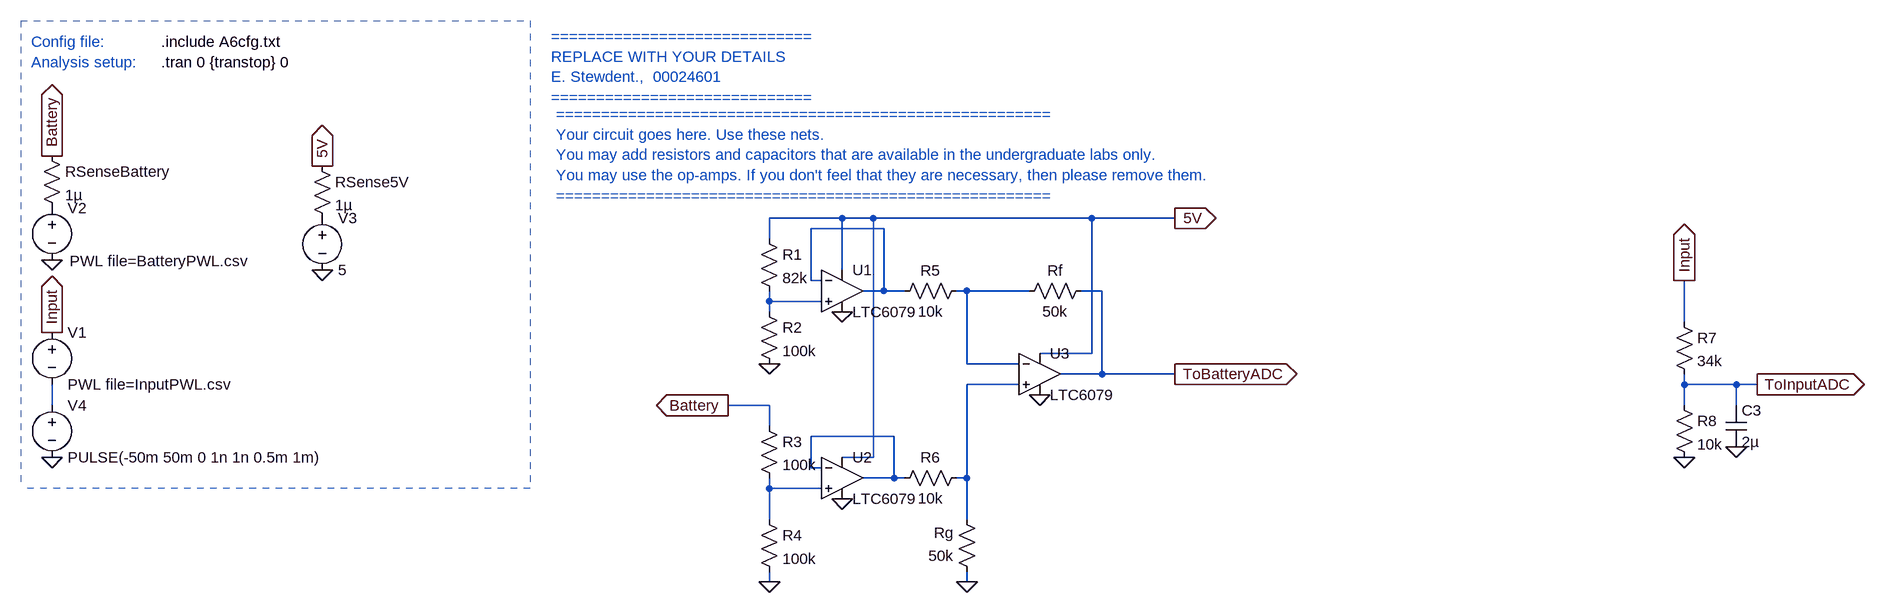
[diagram p0: schematic E344_22546448_A6.asc]
E344_22546448_A6.asc, the LTspice schematic file:
Version 4
SHEET 1 1824 680
WIRE -1104 -1120 -1216 -1120
WIRE -1056 -1120 -1104 -1120
WIRE -720 -1120 -1056 -1120
WIRE -592 -1120 -720 -1120
WIRE -1040 -1104 -1152 -1104
WIRE -1216 -1088 -1216 -1120
WIRE -1104 -1040 -1104 -1120
WIRE -1152 -1024 -1152 -1104
WIRE -1136 -1024 -1152 -1024
WIRE -1040 -1008 -1040 -1104
WIRE -1040 -1008 -1072 -1008
WIRE -1008 -1008 -1040 -1008
WIRE -912 -1008 -928 -1008
WIRE -816 -1008 -912 -1008
WIRE -704 -1008 -736 -1008
WIRE -1216 -992 -1216 -1008
WIRE -1136 -992 -1216 -992
WIRE -1216 -976 -1216 -992
WIRE 192 -960 192 -1024
WIRE -720 -912 -720 -1120
WIRE -720 -912 -800 -912
WIRE -912 -896 -912 -1008
WIRE -832 -896 -912 -896
WIRE -704 -880 -704 -1008
WIRE -704 -880 -768 -880
WIRE -592 -880 -704 -880
WIRE -832 -864 -912 -864
WIRE 192 -864 192 -880
WIRE 272 -864 192 -864
WIRE 304 -864 272 -864
WIRE -2320 -832 -2320 -864
WIRE -1216 -832 -1280 -832
WIRE 192 -832 192 -864
WIRE 272 -832 272 -864
WIRE -1216 -800 -1216 -832
WIRE -1024 -784 -1152 -784
WIRE -1056 -752 -1056 -1120
WIRE -1056 -752 -1104 -752
WIRE -1152 -736 -1152 -784
WIRE -1136 -736 -1152 -736
WIRE -1024 -720 -1024 -784
WIRE -1024 -720 -1072 -720
WIRE -1008 -720 -1024 -720
WIRE -912 -720 -912 -864
WIRE -912 -720 -928 -720
WIRE -1216 -704 -1216 -720
WIRE -1136 -704 -1216 -704
WIRE -1216 -656 -1216 -704
WIRE -912 -656 -912 -720
WIRE -1216 -560 -1216 -576
WIRE -912 -560 -912 -576
FLAG -2320 -944 Input
IOPIN -2320 -944 Out
FLAG -1904 -1040 0
FLAG -1104 -976 0
FLAG -2320 -752 0
FLAG -2320 -1056 0
FLAG 304 -864 ToInputADC
IOPIN 304 -864 Out
FLAG -592 -880 ToBatteryADC
IOPIN -592 -880 Out
FLAG -1904 -1200 5V
IOPIN -1904 -1200 Out
FLAG -2320 -1216 Battery
IOPIN -2320 -1216 Out
FLAG -1280 -832 Battery
IOPIN -1280 -832 Out
FLAG 192 -1024 Input
IOPIN 192 -1024 Out
FLAG -592 -1120 5V
IOPIN -592 -1120 Out
FLAG -800 -848 0
FLAG -1104 -688 0
FLAG -1216 -560 0
FLAG -912 -560 0
FLAG -1216 -896 0
FLAG 192 -752 0
FLAG 272 -768 0
SYMBOL voltage -2320 -960 R0
WINDOW 123 0 0 Left 0
WINDOW 39 0 0 Left 0
SYMATTR InstName V1
SYMATTR Value PWL file=InputPWL.csv
SYMBOL voltage -2320 -1152 R0
WINDOW 123 0 0 Left 0
WINDOW 39 0 0 Left 0
WINDOW 3 27 98 Left 2
SYMATTR Value PWL file=BatteryPWL.csv
SYMATTR InstName V2
SYMBOL voltage -1904 -1136 R0
WINDOW 123 0 0 Left 0
WINDOW 39 0 0 Left 0
SYMATTR InstName V3
SYMATTR Value 5
SYMBOL voltage -2320 -848 R0
WINDOW 123 0 0 Left 0
WINDOW 39 0 0 Left 0
SYMATTR InstName V4
SYMATTR Value PULSE(-50m 50m 0 1n 1n 0.5m 1m)
SYMBOL res -1920 -1216 R0
SYMATTR InstName RSense5V
SYMATTR Value 1µ
SYMBOL res -2336 -1232 R0
SYMATTR InstName RSenseBattery
SYMATTR Value 1µ
SYMBOL OpAmps\\LTC6079 -1104 -1008 R0
SYMATTR InstName U1
SYMBOL OpAmps\\LTC6079 -1104 -720 R0
SYMATTR InstName U2
SYMBOL OpAmps\\LTC6079 -800 -880 R0
SYMATTR InstName U3
SYMBOL res -912 -1024 R90
WINDOW 0 0 56 VBottom 2
WINDOW 3 32 56 VTop 2
SYMATTR InstName R5
SYMATTR Value 10k
SYMBOL res -912 -736 R90
WINDOW 0 0 56 VBottom 2
WINDOW 3 32 56 VTop 2
SYMATTR InstName R6
SYMATTR Value 10k
SYMBOL res -896 -560 R180
WINDOW 0 36 76 Left 2
WINDOW 3 36 40 Left 2
SYMATTR InstName Rg
SYMATTR Value 50k
SYMBOL res -832 -992 R270
WINDOW 0 32 56 VTop 2
WINDOW 3 0 56 VBottom 2
SYMATTR InstName Rf
SYMATTR Value 50k
SYMBOL res -1232 -992 R0
SYMATTR InstName R2
SYMATTR Value 100k
SYMBOL res -1232 -1104 R0
SYMATTR InstName R1
SYMATTR Value 82k
SYMBOL res -1232 -672 R0
SYMATTR InstName R4
SYMATTR Value 100k
SYMBOL res -1232 -816 R0
SYMATTR InstName R3
SYMATTR Value 100k
SYMBOL res 176 -976 R0
SYMATTR InstName R7
SYMATTR Value 34k
SYMBOL res 176 -848 R0
SYMATTR InstName R8
SYMATTR Value 10k
SYMBOL cap 256 -832 R0
SYMATTR InstName C3
SYMATTR Value 2µ
TEXT -2152 -1360 Left 2 !.tran 0 {transtop} 0
TEXT -2152 -1392 Left 2 !.include A6cfg.txt
TEXT -2352 -1392 Left 2 ;Config file:
TEXT -2352 -1360 Left 2 ;Analysis setup:
TEXT -1552 -1400 Left 2 ;=============================\nREPLACE WITH YOUR DETAILS\nE. Stewdent.,  00024601\n=============================
TEXT -1544 -1280 Left 2 ;=======================================================\nYour circuit goes here. Use these nets.\nYou may add resistors and capacitors that are available in the undergraduate labs only.\nYou may use the op-amps. If you don't feel that they are necessary, then please remove them.\n=======================================================
LINE Normal -1584 -1424 -1584 -704 2
LINE Normal -2368 -1424 -1584 -1424 2
LINE Normal -1584 -704 -2368 -704 2
LINE Normal -1584 -720 -1584 -720 2
LINE Normal -2368 -1424 -2368 -704 2

The netlist it stands for:
* E344_22546448_A6.asc
V1 Input N005 PWL file=InputPWL.csv
V2 P001 0 PWL file=BatteryPWL.csv
V3 P002 0 5
V4 N005 0 PULSE(-50m 50m 0 1n 1n 0.5m 1m)
RSense5V 5V P002 1µ
RSenseBattery Battery P001 1µ
XU1 N003 N001 5V 0 N001 LTC6078  ; LTC6079, pins In+ In- V+ V- OUT
XU2 N007 N006 5V 0 N006 LTC6078  ; LTC6079, pins In+ In- V+ V- OUT
XU3 N004 N002 5V 0 ToBatteryADC LTC6078  ; LTC6079, pins In+ In- V+ V- OUT
R5 N002 N001 10k
R6 N004 N006 10k
Rg 0 N004 50k
Rf N002 ToBatteryADC 50k
R2 N003 0 100k
R1 5V N003 82k
R4 N007 0 100k
R3 Battery N007 100k
R7 Input ToInputADC 34k
R8 ToInputADC 0 10k
C3 ToInputADC 0 2µ
.tran 0 {transtop} 0
.include A6cfg.txt
* Config file:
* Analysis setup:
* =============================
* REPLACE WITH YOUR DETAILS
* E. Stewdent.,  00024601
* =============================
* =======================================================
* Your circuit goes here. Use these nets.
* You may add resistors and capacitors that are available in the undergraduate labs only.
* You may use the op-amps. If you don't feel that they are necessary, then please remove them.
* =======================================================
.lib LTC5.lib
.backanno
.end

* Results of the author's LTspice run, read from the files saved beside the schematic
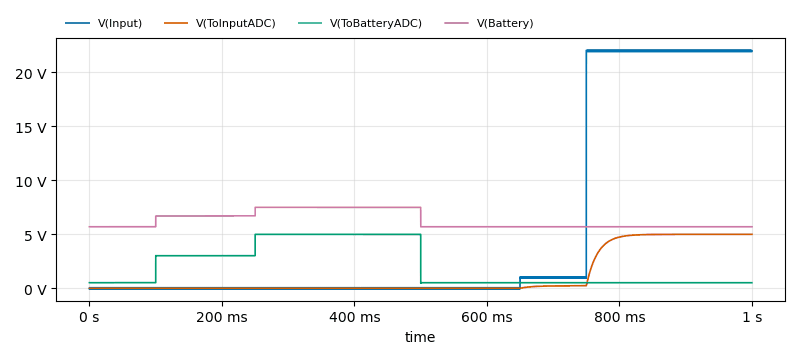
[diagram p1: Transient Analysis of E344_22546448_A6.asc, plotted from the saved traces]
* Transient Analysis, 1 run:
*   V(Input): min -50 mV, max 22.05 V, average 5.599 V, rms 11 V, last 21.95 V
*   V(ToInputADC): min -11.36 mV, max 5 V, average 1.187 V, rms 2.374 V, last 5 V
*   V(ToBatteryADC): min 468.7 mV, max 4.998 V, average 2.01 V, rms 2.787 V, last 513.7 mV
*   V(Battery): min 5.7 V, max 7.5 V, average 6.3 V, rms 6.347 V, last 5.7 V